# EAGLE design TamaCollar1_Mk1_(V45) (EAGLE 9.7.0)
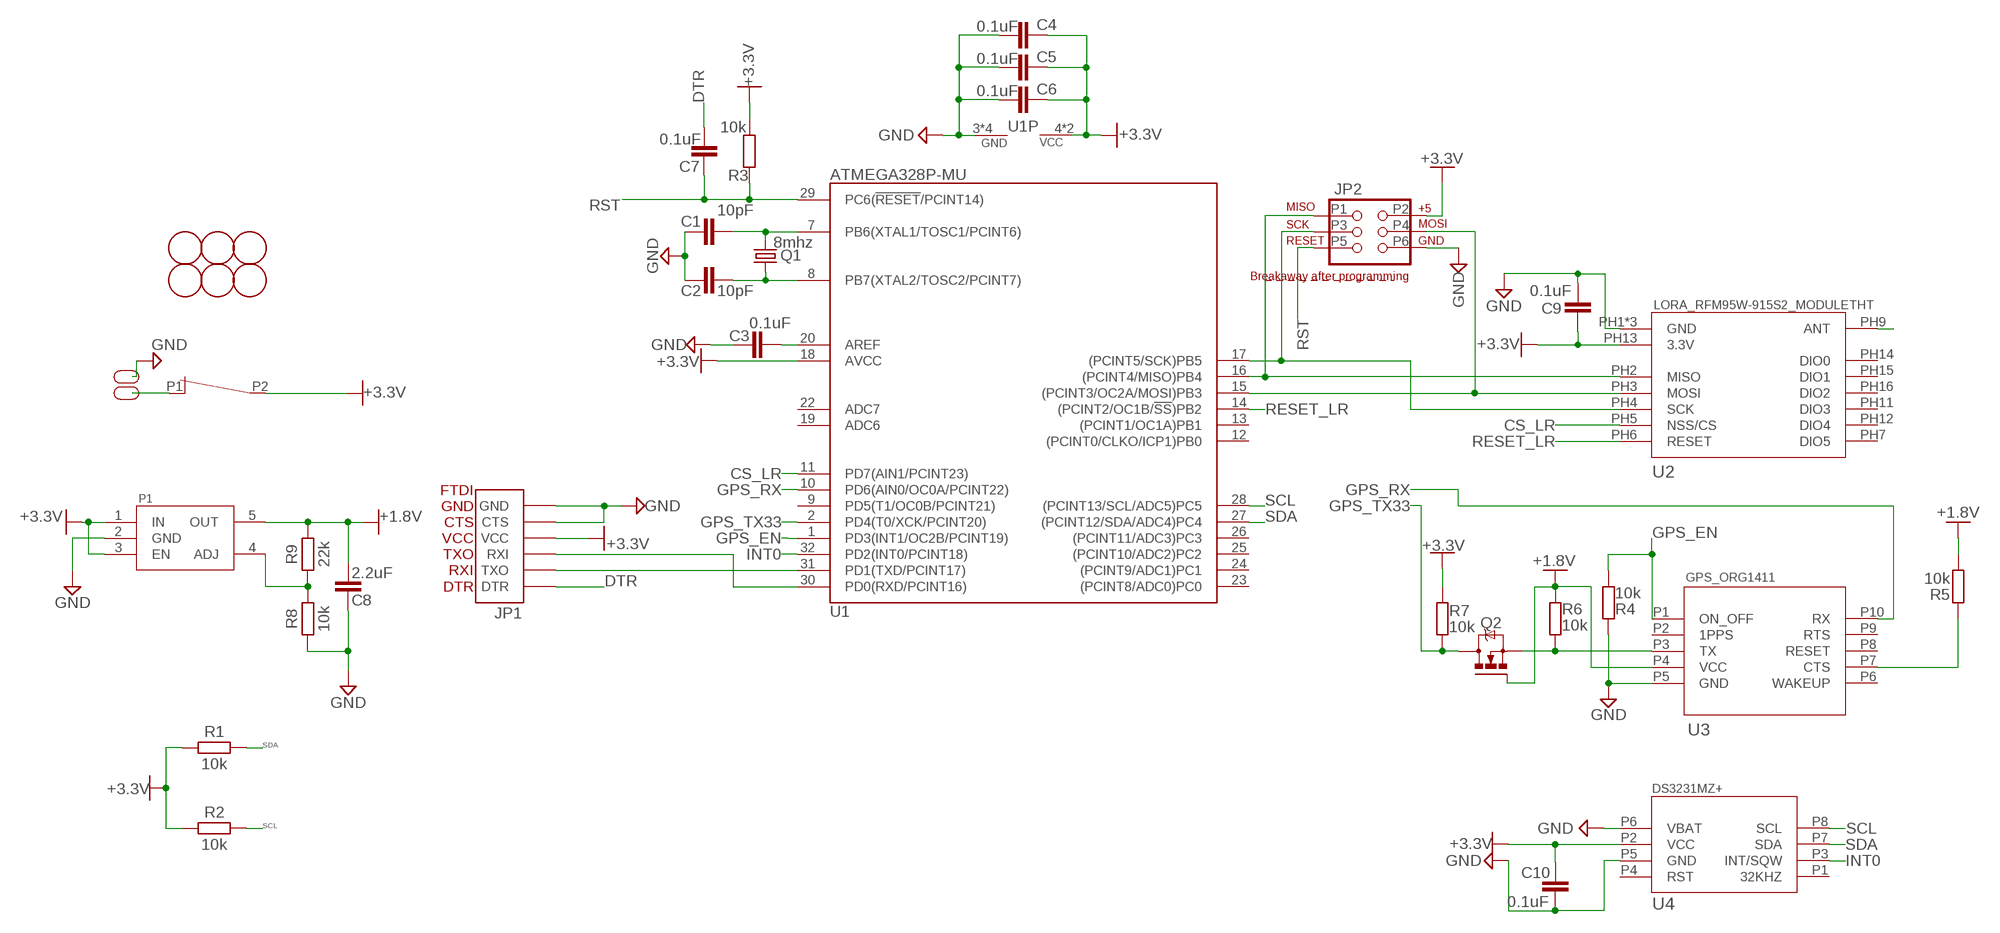
[diagram p0: schematic, sheet 1]

## Parts
BATT+  BREAKOUT_PADL  [BREAKOUT_PAD*1*1X2MM]
BR2  MOUSEBITE3X1.25  [MOUSEBITE_3H_6TRACE(1.25MM)]
C1  10pF  C_CHIP-0402(1005-METRIC)  [CAPC1005X60]
C2  10pF  C_CHIP-0402(1005-METRIC)  [CAPC1005X60]
C3  0.1uF  C_CHIP-0402(1005-METRIC)  [CAPC1005X60]
C4  0.1uF  C_CHIP-0402(1005-METRIC)  [CAPC1005X60]
C5  0.1uF  C_CHIP-0402(1005-METRIC)  [CAPC1005X60]
C6  0.1uF  C_CHIP-0402(1005-METRIC)  [CAPC1005X60]
C7  0.1uF  C_CHIP-0402(1005-METRIC)  [CAPC1005X60]
C8  2.2uF  C_CHIP-0402(1005-METRIC)  [CAPC1005X60]
C9  0.1uF  C_CHIP-0402(1005-METRIC)  [CAPC1005X60]
C10  0.1uF  C_CHIP-0402(1005-METRIC)  [CAPC1005X60]
F1  FIDUCIAL  [FIDUCIAL_1MM]
F2  FIDUCIAL  [FIDUCIAL_1MM]
F3  FIDUCIAL  [FIDUCIAL_1MM]
F4  FIDUCIAL  [FIDUCIAL_1MM]
F5  FIDUCIAL  [FIDUCIAL_1MM]
F6  FIDUCIAL  [FIDUCIAL_1MM]
GND  BREAKOUT_PADL  [BREAKOUT_PAD*1*1X2MM]
JP1  FTDI_DEVICESMALL  [FTDI_DEVICE_SMD_SMALL]
JP2  AVR_SPI_PRG_61X6  [1X6-SMD]
P1  LDO_MIC5205YM5  [MIC5205]
Q1  8mhz  CRYSTAL  [CRYSTAL_NX3225GD]
Q2  NMOSFET  NMOSFETSOT23  [SOT23]
R1  10k  R_CHIP-0402(1005-METRIC)  [RESC1005X40]
R2  10k  R_CHIP-0402(1005-METRIC)  [RESC1005X40]
R3  10k  R_CHIP-0402(1005-METRIC)  [RESC1005X40]
R4  10k  R_CHIP-0402(1005-METRIC)  [RESC1005X40]
R5  10k  R_CHIP-0402(1005-METRIC)  [RESC1005X40]
R6  10k  R_CHIP-0402(1005-METRIC)  [RESC1005X40]
R7  10k  R_CHIP-0402(1005-METRIC)  [RESC1005X40]
R8  10k  R_CHIP-0402(1005-METRIC)  [RESC1005X40]
R9  22k  R_CHIP-0402(1005-METRIC)  [RESC1005X40]
SW1  REED_SWITCH  [REED_CT05]
U1  ATMEGA328P-MU  [QFN32_5X5_0.50]
U2  LORA_RFM95W-915S2_MODULETHT  [LORA_RFM95W-915S2_16STANDOFFMODULE]
U3  GPS_ORG1411  [ORG1411]
U4  DS3231MZ+  [DS3231MZ+_SOIC8]

## Nets
+1.8V [Power]: C8.2 P1.5(OUT) Q2.1(G) R5.1 R6.2 R9.2 U3.P4(VCC)
+3.3V [Power]: C4.1 C5.1 C6.1 C9.1 C10.1 JP1.P4(VCC) JP2.P2 P1.1(IN) P1.3(EN) R1.1 R2.1 R3.1 R7.2 SW1.P2(PAD2) U1.4(VCC) U1.6(VCC) U1.18(AVCC) U2.PH13(3.3V) U4.P2(VCC)
+BATT [Power]: BATT+.P$1 SW1.P1(PAD1)
AREF: C3.2 U1.20(AREF)
CS_LR: U1.11(PD7(AIN1/PCINT23)) U2.PH5(NSS/CS)
DTR: C7.2 JP1.P1(DTR)
GND [Power]: C1.1 C2.1 C3.1 C4.2 C5.2 C6.2 C8.1 C9.2 C10.2 GND.P$1 JP1.P5(CTS) JP1.P6(GND) JP2.P6 P1.2(GND) R4.2 R8.1 U1.3(GND) U1.5(GND) U1.21(GND) U1.EXP(GND) U2.PH1(GND) U2.PH8(GND) U2.PH10(GND) U3.P5(GND) U4.P5(GND) U4.P6(VBAT)
GPS_CTS: R5.2 U3.P7(CTS)
GPS_EN: R4.1 U1.1(PD3(INT1/OC2B/PCINT19)) U3.P1(ON_OFF)
GPS_RX: U1.10(PD6(AIN0/OC0A/PCINT22)) U3.P10(RX)
GPS_TX18: Q2.2(S) R6.1 U3.P3(TX)
GPS_TX33: Q2.3(D) R7.1 U1.2(PD4(T0/XCK/PCINT20))
INT0: U1.32(PD2(INT0/PCINT18)) U4.P3(INT/SQW)
LR_ANT [RF]: U2.PH9(ANT)
MISO: JP2.P1 U1.16((PCINT4/MISO)PB4) U2.PH2(MISO)
MOSI: JP2.P4 U1.15((PCINT3/OC2A/MOSI)PB3) U2.PH3(MOSI)
P1ADJ [Power]: P1.4(ADJ) R8.2 R9.1
Q1: C1.2 Q1.P2 U1.7(PB6(XTAL1/TOSC1/PCINT6))
Q2: C2.2 Q1.P1 U1.8(PB7(XTAL2/TOSC2/PCINT7))
RESET_LR: U1.14((PCINT2/OC1B/!SS!)PB2) U2.PH6(RESET)
RST: C7.1 JP2.P5 R3.2 U1.29(PC6(!RESET!/PCINT14))
RXD: JP1.P3(RXI) U1.30(PD0(RXD/PCINT16))
SCK: JP2.P3 U1.17((PCINT5/SCK)PB5) U2.PH4(SCK)
SCL: R2.2 U1.28((PCINT13/SCL/ADC5)PC5) U4.P8(SCL)
SDA: R1.2 U1.27((PCINT12/SDA/ADC4)PC4) U4.P7(SDA)
TXD: JP1.P2(TXO) U1.31(PD1(TXD/PCINT17))
Unconnected: U1.9(PD5(T1/OC0B/PCINT21)) U1.12((PCINT0/CLKO/ICP1)PB0) U1.13((PCINT1/OC1A)PB1) U1.19(ADC6) U1.22(ADC7) U1.23((PCINT8/ADC0)PC0) U1.24((PCINT9/ADC1)PC1) U1.25((PCINT10/ADC2)PC2) U1.26((PCINT11/ADC3)PC3) U2.PH7(DIO5) U2.PH11(DIO3) U2.PH12(DIO4) U2.PH14(DIO0) U2.PH15(DIO1) U2.PH16(DIO2) U3.P2(1PPS) U3.P6(WAKEUP) U3.P8(RESET) U3.P9(RTS) U4.P1(32KHZ) U4.P4(RST)

## Notes on the sheet
- FTDI
  GND
  CTS
  VCC
  TXO
  RXI
  DTR

## Library data of the parts
BATT+ GND = CDC Library:BREAKOUT_PAD
BR2 = CDC Library:MOUSEBITE
C1 C2 = Capacitor:C: Capacitor - Generic; CATEGORY: Capacitor; LINK: https://www.evelta.com/10-pf-50v-0402-smd-multilayer-ceramic-capacitors-cc0402jrnpo9bn100-yageo/
C3-C7 C9 C10 = Capacitor:C: Capacitor - Generic; CATEGORY: Capacitor; LINK: https://www.evelta.com/100-nf-25v-0402-smd-multi-layer-ceramic-capacitor-0402x104k250ct-walsin/
C8 = Capacitor:C: Capacitor - Generic; CATEGORY: Capacitor; LINK: https://www.comkey.in/passive-components/capacitors/0402x225m6r3ct
F1-F6 = CDC Library:FIDUCIAL: For use by pick and place machines to calibrate the vision/machine, 1mm By microbuilder.eu
JP1 = CDC Library:FTDI_DEVICE: Connector which mates to FTDI basic or FTDI cable.
JP2 = CDC Library:AVR_SPI_PRG_6: AVR ISP 6 Pin This is the reduced ISP connector for AVR programming. Common on Arduino. This footprint will take up less PCB space and can be used with a 10-pin to 6-pin adapter such as SKU: BOB-08508 **Special note about "TEST_POINT" package. The stop mask is on the top side, so if you want your programming test points to be on the bottom of your board, make sure to place this package on the bottom side of the board. This also ensure that the orientation to program from the bottom side will be correct.
P1 = CDC Library:LDO_MIC5205YM5
Q1 = CDC Library:CRYSTAL: CRYSTAL; LINK: https://www.evelta.com/nx3225gd-8mhz-std-cra-3-8mhz-50ppm-crystal-8pf-surface-mount-2-smd-for-automotive/
Q2 = Transistor:NMOSFET: N-Channel MOSFET - Generic; CATEGORY: Transistor; LINK: https://www.evelta.com/bss138lt1g-50v-220ma-n-channel-transistor-surface-mount-sot-23-3/; SUB-CATEGORY: MOSFET; TYPE: N-Channel
R1 R2 = Resistor:R: Resistor Fixed - Generic; CATEGORY: Resistor; LINK: https://www.sunrom.com/p/4k7-1-0805-pack-of-100; SUB-CATEGORY: Fixed
R3 = Resistor:R: Resistor Fixed - Generic; CATEGORY: Resistor; LINK: https://www.sunrom.com/p/10k-1-0603-pack-of-100; SUB-CATEGORY: Fixed
R4-R8 = Resistor:R: Resistor Fixed - Generic; CATEGORY: Resistor; LINK: https://www.evelta.com/10k-1-0402-smd-thick-film-chip-resistor-royal-ohm-0402wgf1002tce/; SUB-CATEGORY: Fixed
R9 = Resistor:R: Resistor Fixed - Generic; CATEGORY: Resistor; LINK: https://www.evelta.com/22k-1-0402-smd-thick-film-chip-resistor-royal-ohm-0402wgf2202tce/; SUB-CATEGORY: Fixed
SW1 = CDC Library:REED_SWITCH
U1 = CDC Library:ATMEGA*8: 8-bit AVR Microcontroller 4/8/16/32 kbytes flash 512/1k/1k/2k bytes SRAM 256/512/512/1k bytes EEPROM USART, 6/8-channel 10 bit ADC Pin compatible with Atmega8(L,A) Note: ADC6 and ADC7 are not available in 28-lead packages; LINK: https://www.rhydolabz.com/components-microcontrollers-c-172_192/atmega328pmu-smd-p-2612.html
U2 = CDC Library:LORA_RFM95W-915S2_MODULE; LINK: https://www.digikey.in/product-detail/en/rf-solutions/RFM95W-915S2/RFM95W-915S2-ND/6564923
U3 = CDC Library:GPS_ORG1411
U4 = CDC Library:DS3231MZ+; LINK: https://www.evelta.com/ds3231mz-maxim-integrated-alarm-rtc-i2c-2-3-v-to-5-5-v/

## Board
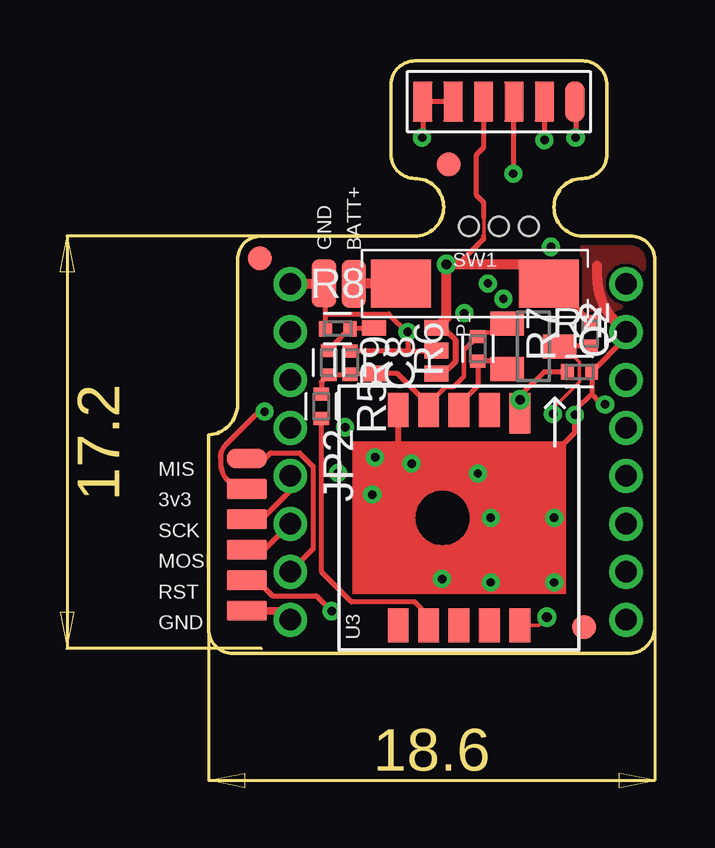
[diagram p1: board, top side]
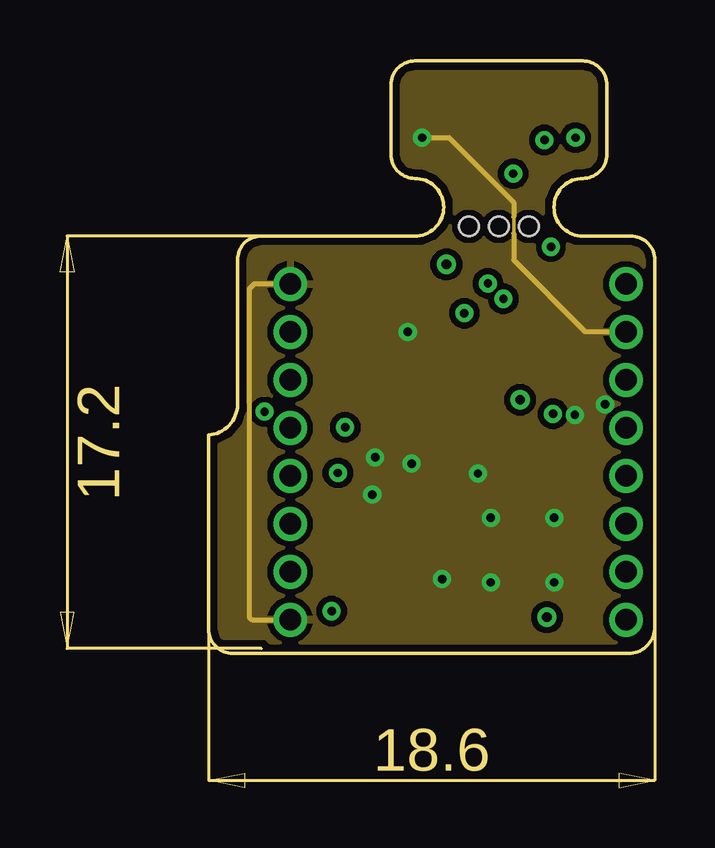
[diagram p2: board, inner layer Route2]
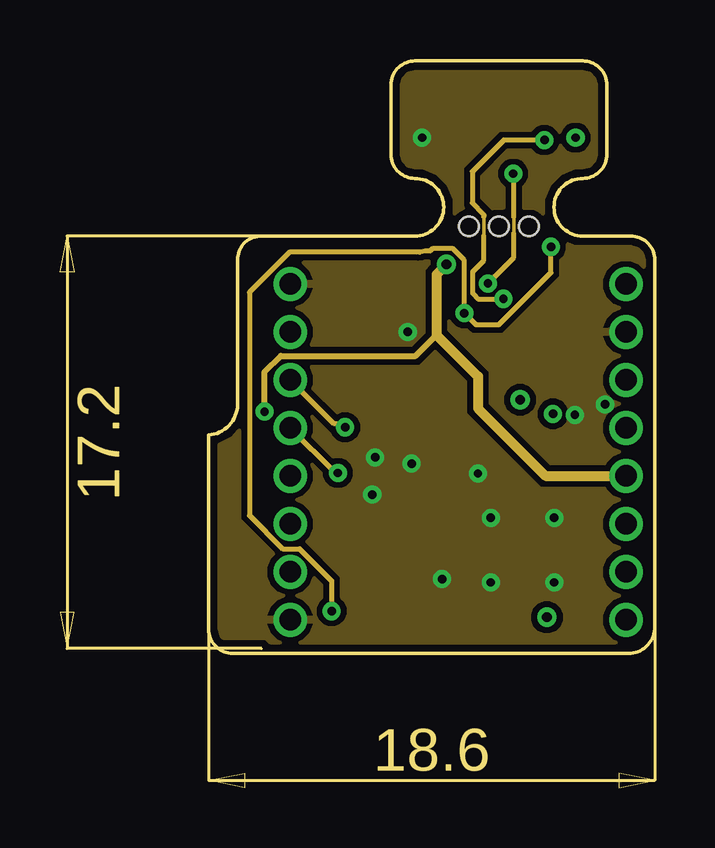
[diagram p3: board, inner layer Route15]
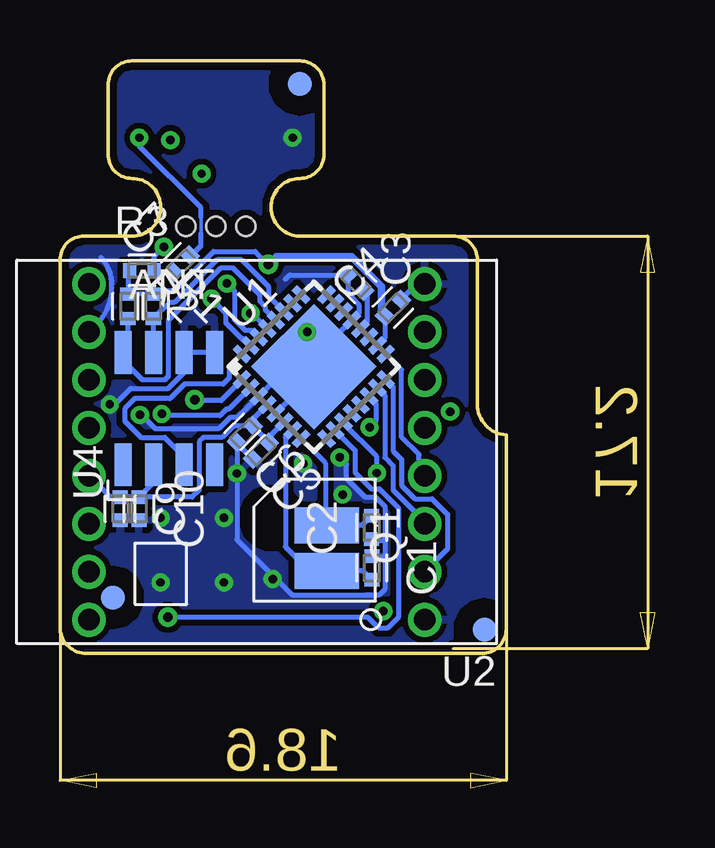
[diagram p4: board, bottom side, seen from below]

Size 18.6 x 24.7 mm. Coordinates in mm from the lower left corner, seen from the top.
Outline: 17.6,17.4 arc-90 18.6,16.4 18.6,1.2 arc-90 17.6,0 2.2,0 1,0 arc-90 0,1 0,9.1 arc90 1.2,10.5 1.2,16.4 arc-90 2.2,17.4 8.6,17.4 arc90 9.8,18.6 arc90 8.6,19.8 arc-90 7.6,20.8 7.6,23.7 arc-90 8.6,24.7 15.6,24.7 arc-90 16.6,23.7 16.6,20.8 arc-90 15.6,19.8 arc90 14.4,18.6 arc90 15.6,17.4 17.6,17.4
Copper layers (1+2*15+16): Top 0.035mm / dielectric 0.12mm / Route2 0.035mm / dielectric 1.165mm / Route15 0.035mm / dielectric 0.12mm / Bottom 0.035mm
Design rules "LionCircuits(4_Layer)": minimum track width 6mil, minimum drill 0.35mm, track to track 6mil, track to pad 6mil, pad to pad 6mil, via to via 6mil, smd to smd 6mil, copper to edge 12mil, drill to drill 12mil, minimum pad ring 10mil, minimum via ring 8mil, stop-mask expansion 4mil, vias tented up to drill 0.4mm, thermal gap 10mil

### Footprints (pad centres in the part's own frame; a part is rotated, then mirrored left to right if it is on the bottom)
BREAKOUT_PAD*1*1X2MM = smd 2 x 1: P$1 0,0
MOUSEBITE_3H_6TRACE(1.25MM) = hole 0.8: 1,0; 1,1.25; 1,-1.25
CAPC1005X60 = smd 0.56 x 0.629: 1 -0.485,0; 2 0.485,0
FIDUCIAL_1MM = smd 1 x 1: 1 0,0
FTDI_DEVICE_SMD_SMALL = smd 0.813 x 1.676: P1 -3.175,0; P2 -1.905,0; P3 -0.635,0; P4 0.635,0; P5 1.905,0; P6 3.175,0
1X6-SMD = smd 0.813 x 1.676: P1 -2.54,0; P2 -1.27,0; P3 0,0; P4 1.27,0; P5 2.54,0; P6 3.81,0
MIC5205 = smd 0.66 x 1: 1 0.95,1.3; 2 0,1.3; 3 -0.95,1.3; 4 -0.95,-1.3; 5 0.95,-1.3
CRYSTAL_NX3225GD = smd 1.5 x 2.7: P1 -0.95,0; P2 0.95,0
SOT23 = smd 1 x 1.4: 1 -0.95,-1.1; 2 0.95,-1.1; 3 0,1.1
RESC1005X40 = smd 0.535 x 0.644: 1 -0.507,0; 2 0.507,0
REED_CT05 = smd 2.5 x 2: P1 -3.08,0; P2 3.08,0
QFN32_5X5_0.50 = smd 0.8 x 0.3: 1 -2.5,1.75; 2 -2.5,1.25; 3 -2.5,0.75; 4 -2.5,0.25; 5 -2.5,-0.25; 6 -2.5,-0.75; 7 -2.5,-1.25; 8 -2.5,-1.75; 17 2.5,-1.75; 18 2.5,-1.25; 19 2.5,-0.75; 20 2.5,-0.25; 21 2.5,0.25; 22 2.5,0.75; 23 2.5,1.25; 24 2.5,1.75 | smd 0.3 x 0.8: 9 -1.75,-2.5; 10 -1.25,-2.5; 11 -0.75,-2.5; 12 -0.25,-2.5; 13 0.25,-2.5; 14 0.75,-2.5; 15 1.25,-2.5; 16 1.75,-2.5; 25 1.75,2.5; 26 1.25,2.5; 27 0.75,2.5; 28 0.25,2.5; 29 -0.25,2.5; 30 -0.75,2.5; 31 -1.25,2.5; 32 -1.75,2.5 | smd 3.7 x 3.7: EXP 0,0
LORA_RFM95W-915S2_16STANDOFFMODULE = drill 0.9: PH1 -7,7; PH2 -7,5; PH3 -7,3; PH4 -7,1; PH5 -7,-1; PH6 -7,-3; PH7 -7,-5; PH8 -7,-7; PH9 7,-7; PH10 7,-5; PH11 7,-3; PH12 7,-1; PH13 7,1; PH14 7,3; PH15 7,5; PH16 7,7
ORG1411 = smd 1.676 x 0.864: P1 4.362,-2.54 | smd 1.422 x 0.864: P2 4.489,-1.27; P3 4.489,0; P4 4.489,1.27; P5 4.489,2.54; P6 -4.489,2.54; P7 -4.489,1.27; P8 -4.489,0; P9 -4.489,-1.27; P10 -4.489,-2.54
DS3231MZ+_SOIC8 = smd 1.78 x 0.72: P1 -2.34,1.905; P2 -2.34,0.635; P3 -2.34,-0.635; P4 -2.34,-1.905; P5 2.34,-1.905; P6 2.34,-0.635; P7 2.34,0.635; P8 2.34,1.905

### Placement (x,y rotation side)
BATT+  6.05,15.41 90 top
BR2  12.1,18.8 270 top
C1  5.6,3.56 270 bottom
C2  5.61,5.25 90 bottom
C3  6.26,15.45 315 bottom
C4  4.72,14.41 45 bottom
C5  10.22,8.44 225 bottom
C6  10.9,9.15 225 bottom
C7  13.53,16.25 45 bottom
C8  5.9,12.12 270 top
C9  16.09,6.03 270 bottom
C10  15.31,6.03 270 bottom
F1  15.66,1.09 0 top
F2  10.01,20.38 0 top
F3  2.14,16.46 0 top
F4  16.39,2.33 0 bottom
F5  0.9,0.99 0 bottom
F6  8.61,23.74 0 bottom
GND  4.81,15.42 90 top
JP1  12.1,23 180 top
JP2  1.59,5.58 270 top
P1  8.2,12.62 270 top
Q1  7.48,4.39 270 bottom
Q2  13.54,12.8 270 top
R1  14.71,14.47 270 bottom
R2  15.76,14.47 270 bottom
R3  15.19,15.96 0 bottom
R4  15.46,11.73 0 top
R5  4.7,10.3 270 top
R6  11.22,12.7 90 top
R7  15.91,13.33 90 top
R8  5.38,13.54 0 top
R9  5,12.12 270 top
SW1  11.1,15.42 0 top
U1  8.02,11.95 45 bottom
U2  10.4,8.4 180 bottom
U3  10.44,5.65 90 top
U4  14.06,10.2 90 bottom

### Tracks (layer width: path | path; a pad name or v marks a point on that pad's centre or on a via)
+1.8V
  Top 0.18: 9.17,10.4 9.87,11.1 10.21,11.1 10.65,11.53 10.65,12.64 R6.2 11.38,13.37 11.88,13.37 12.35,13.84 Q2.1
  Top 0.2: R5.1 4.7,11.31 R9.2 5.88,11.61 C8.2 6.87,11.63 P1.5 7.87,11.67 9.17,10.37 U3.P4 9.17,10.4
+3.3V  (via drill 0.35, 0.4)
  Top 0.152: 11.48,17.4 11.48,18.2
  Top 0.2: 9.74,11.67 P1.1 | P1.3 9.74,13.57 | R7.2 14.33,15.42 SW1.P2 13.39,16.21 | v2.33,10.08 2.11,10.08 0.71,8.68 arc45 0.5,8.17 0.5,7.92 arc45 0.8,7.2 1.15,6.86 JP2.P2 | JP1.P4 11.48,21.1 11.17,20.8 11.17,19.11 11.48,18.8 11.48,18.2 | v9.91,16.21 10.4,16.21 11.48,17.29 11.48,17.4
  Top 0.254: 9.74,13.57 9.78,13.57 10.28,13.07 10.28,12.17 9.78,11.67 9.74,11.67
  Top 0.406: P1.3 9.91,13.98 v9.91,16.21 13.39,16.21
  Route15 0.254: v2.33,10.08 2.33,11.72 3.01,12.4 8.63,12.4 9.5,13.27
  Route15 0.406: U2.PH13 14.04,7.4 11.23,10.21 11.23,11.54 9.5,13.27 9.5,15.8 v9.91,16.21
  Bottom 0.2: U1.18 5.06,13.14 C4.1 | R3.1 15.76,15.89 R2.1 R1.1 14.56,15.13 13.83,15.13 12.2,16.76 10.46,16.76 v9.91,16.21 | C10.1 14.7,7.12 U4.P2 | U2.PH13 16.52,6.51 C9.1 C10.1 | U1.6 9.78,9.13 9.78,8.89 C5.1 10.56,9.46 C6.1 | U1.4 10.56,9.77 C6.1 | C6.1 10.57,9.48 11.37,9.48 11.85,9 12.62,9 12.8,8.82 12.8,6.8 13.09,6.51 C10.1
  Bottom 0.305: C4.1 5.19,14.2 5.19,15.29 6.45,16.55 9.58,16.55 v9.91,16.21
+BATT
  Top 0.2: SW1.P1
  Top 0.406: SW1.P1 BATT+.P$1
AREF
  Bottom 0.2: C3.2 5.92,15.04 5.79,14.91 5.79,13.83 U1.20
CS_LR  (via drill 0.35)
  Route15 0.2: v5.39,7.52 5.28,7.52 U2.PH5
  Bottom 0.2: v5.39,7.52 5.41,7.54 5.41,8.22 6.78,9.59 U1.11
DTR  (via drill 0.35)
  Top 0.2: JP1.P1 15.3,22.98 v15.3,21.5
  Bottom 0.152: 12.73,18.2 12.73,17.5
  Bottom 0.2: 12.73,18.2 12.73,18.57 15.3,21.15 v15.3,21.5 | C7.2 13.13,16.59 12.73,17 12.73,17.5
GND  (via drill 0.35)
  Top 0.2: P1.2 9.48,12.61 8.3,12.61 | 8.3,12.61 C8.1 | R8.1 4.87,14.15 | 4.87,14.15 4.87,15.36 GND.P$1 | 8.3,12.61 8.3,13.36 7.5,14.15 4.87,14.15 | 14.41,8.35 15.27,9.21 15.27,10.12 | 15.97,10.81 R4.2 17.4,13.16 U2.PH10 | 15.97,10.81 15.27,10.12 | v16.53,10.38 16.4,10.38 15.97,10.81 | 15.27,10.12 15.27,10.11 v15.27,9.94 | JP1.P5 JP1.P6 8.93,21.52 v8.9,21.5
  Top 0.254: U3.P5 7.9,8.47 v8.46,7.91
  Top 0.305: JP2.P6 3.03,1.77 U2.PH1
  Top 0.406: U2.PH10 16.94,13.86 arc-45 16.2,15.65 16.2,16.16 | GND.P$1 4.79,15.4 U2.PH8
  Route2 0.152: 12.73,18.2 12.73,17.5
  Route2 0.2: U2.PH10 15.7,13.4 12.73,16.4 12.73,17.5 | 12.73,18.2 12.73,18.8 10.03,21.5 v8.9,21.5 | U2.PH8 1.9,15.4 1.69,15.19 1.69,1.51 1.8,1.4 U2.PH1
  Bottom 0.2: 9.7,10.01 U1.5 8.02,11.6 U1.EXP | U1.EXP 8.02,12.3 U1.21 6.14,14.18 6.14,14.53 6.6,14.99 C3.1 6.62,15.77 9.03,15.77 9.2,15.6 | U1.EXP 9.08,11.95 U1.3 11.2,9.83 11.52,9.83 12,9.36 14.62,9.36 15.21,9.94 v15.27,9.94 | C5.2 11.24,8.78 C6.2 11.23,8.79 v11.23,7.5 11.23,4.73 8.94,2.44 5.29,2.44 5.03,2.69 5.03,4.04 | 5.03,4.04 5.03,4.7 | 5.03,4.7 5.03,6.11 5.42,6.5 5.87,6.5 6.65,7.28 6.65,7.88 v6.94,8.17 | U4.P5 U4.P6 13.43,11.71 14.09,11.04 15.66,11.04 16.32,10.38 v16.53,10.38 | C2.1 5.54,4.7 5.03,4.7 | C1.1 5.04,4.04 5.03,4.04 | C9.2 C10.2 | C4.2 3.73,15.4 U2.PH8 | U2.PH10 17.06,13.74 arc-45 16.44,15.24 16.44,15.39 arc-45 16.9,16.5
  other vias: 14.41,5.65 11.77,5.65 6.82,6.62 9.73,3.1 11.77,2.96 14.41,2.96 8.3,13.4
  pour Route15 (isolate 0.254): 1,0 18.1,0 arc90 18.6,0.5 18.6,23.7 arc90 17.6,24.7 1.6,24.7 arc90 0,23.1 0,1 arc90
  pour Route2 (isolate 0.254): 1,0 17.9,0 arc90 18.6,0.7 18.6,23.7 arc90 17.6,24.7 1.6,24.7 arc90 0,23.1 0,1 arc90
  pour Bottom (isolate 0.254): 1,0 18.4,0 arc90 18.6,0.2 18.6,23.7 arc90 17.6,24.7 1.6,24.7 arc90 0,23.1 0,1 arc90
  pour Top: 15.5,17.4 15.5,14.5 16.9,13.1 18.2,13.1 18.5,13.4 18.5,17 18.1,17.4
GPS_CTS
  Top 0.2: U3.P7 9.17,1.57 8.6,2.14 5.96,2.14 4.71,3.39 4.71,8.14 4.7,8.15 R5.2
GPS_EN  (via drill 0.4)
  Top 0.2: 12.99,10.73 12.98,10.72 U3.P1 | R4.1 13.99,11.73 12.99,10.73 | 12.99,10.73 v12.99,10.57
  Bottom 0.2: U1.1 11.02,11.39 11.53,10.89 11.88,10.54 12.8,10.54 12.83,10.57 v12.99,10.57
GPS_RX  (via drill 0.4)
  Top 0.152: U3.P10 13.76,1.16 v14.1,1.5
  Bottom 0.2: U1.10 6.3,8.46 6.3,7.54 5.62,6.86 5.29,6.86 4.5,6.07 4.5,1.5 4.96,1.04 5.3,1.04 5.76,1.5 v14.1,1.5
GPS_TX18
  Top 0.2: Q2.2 12.12,12.19 R6.1 11.22,11.15 10.44,10.37 U3.P3
GPS_TX33  (via drill 0.35)
  Top 0.152: Q2.3 14.8,12.8 15.45,12.15 15.45,11.31 14.38,10.24 14.38,10 v14.36,9.98
  Top 0.2: Q2.3 14.66,12.82 R7.1
  Bottom 0.2: U1.2 11.55,10.19 11.66,10.19 11.94,9.91 14.29,9.91 v14.36,9.98
INT0
  Bottom 0.2: U1.32 11.55,11.96 11.55,11.48 11.8,11.22 13.41,11.22 14.02,10.62 15.48,10.62 15.9,10.2 15.9,9.68 15.22,9 14.23,9 13.43,8.2 U4.P3
MISO
  Top 0.2: JP2.P1 2.36,8.12 2.59,8.36 3.8,8.36 4.36,7.8 4.36,4.36 U2.PH2
  Bottom 0.2: U2.PH2 2.44,4.36 2.44,5.8 3.09,6.44 3.8,6.44 4.36,7 4.36,8.09 4.71,8.44 4.71,11.11 U1.16
MOSI
  Top 0.2: JP2.P4 2.32,4.32 U2.PH3
  Bottom 0.2: U1.15 5.06,10.76 5.06,8.16 4.71,7.81 4.71,6.81 3.4,5.5 U2.PH3
P1ADJ
  Top 0.2: R9.1 5,12.66 5.48,13.14 R8.2 5.92,13.57 P1.4
Q1
  Bottom 0.2: U1.7 9.2,9 9.2,4.45 8.19,3.44 7.4,3.44 | C1.2 5.96,3.44 7.4,3.44 | 7.4,3.44 Q1.P2
Q2
  Bottom 0.2: U1.8 7.54,7.93 7.54,5.4 Q1.P1 6.01,5.34 C2.2
RESET_LR  (via drill 0.35)
  Route15 0.2: U2.PH6 5.21,9.59 5.53,9.59 v5.69,9.43
  Bottom 0.2: U1.14 5.43,10.43 5.43,9.68 v5.69,9.43
RST  (via drill 0.35)
  Top 0.2: JP2.P5 2.03,3.04 2.67,2.4 4.49,2.4 v5.13,1.76
  Route15 0.2: v14.27,16.95 14.27,15.87 12.1,13.7 11.14,13.7 v10.66,14.18 10.66,16.39 10.19,16.87 9.33,16.87 9.23,16.77 9.04,16.77 8.81,16.73 8.8,16.72 3.37,16.72 1.7,15.05 1.7,5.75 3.09,4.36 3.8,4.36 5.13,3.02 v5.13,1.76
  Bottom 0.2: U1.29 10.5,14.08 10.56,14.08 v10.66,14.18 | C7.1 14.63,15.91 R3.2 14.68,16.54 v14.27,16.95
RXD  (via drill 0.35)
  Top 0.2: v12.7,20 12.73,20.04 JP1.P3
  Route15 0.152: 12.73,18.2 12.73,17.5
  Route15 0.2: 12.73,18.2 12.73,19 12.73,19.98 v12.7,20 | v11.64,15.42 12.73,16.5 12.73,17.5
  Bottom 0.2: U1.30 10.61,13.48 10.89,13.48 11.33,13.91 11.33,15.11 v11.64,15.42
SCK
  Top 0.2: JP2.P3 2.22,5.58 3.4,6.77 U2.PH4
  Bottom 0.2: U1.17 4.36,11.82 4.36,9 3.63,8.28 3.63,7.63 U2.PH4
SCL
  Bottom 0.2: R2.2 15.76,12.74 U4.P8 15.97,12.2 15.16,11.4 14.23,11.4 14.09,11.54 14.09,13.88 11.91,16.05 11.38,16.05 10.27,14.94 10.27,14.68 10.03,14.44 10.03,14.31 U1.28
SDA
  Bottom 0.2: U4.P7 14.71,12.55 R1.2 14.04,14.63 13.82,14.63 12.05,16.41 11.04,16.41 9.91,15.28 9.91,14.9 U1.27
TXD  (via drill 0.35)
  Top 0.2: JP1.P2 v14,21.41 v14,21.4
  Route15 0.152: 11.48,18.2 11.48,17.4
  Route15 0.2: v12.29,14.78 11.23,14.78 11.02,15 11.02,15.91 11.48,16.38 11.48,17.4 | 11.48,18.2 11.48,18.3 10.99,18.79 10.99,20.09 12.3,21.4 v14,21.4
  Bottom 0.2: U1.31 10.96,13.12 11.04,13.12 11.68,13.77 11.68,14.17 v12.29,14.78

### Text on the board
tPlace: MIS / 3v3 / SCK / MOSI / RST / GND
Document: Do not populate LR ANT